# EAGLE schematic MOSFETboard (EAGLE 9.6.2)
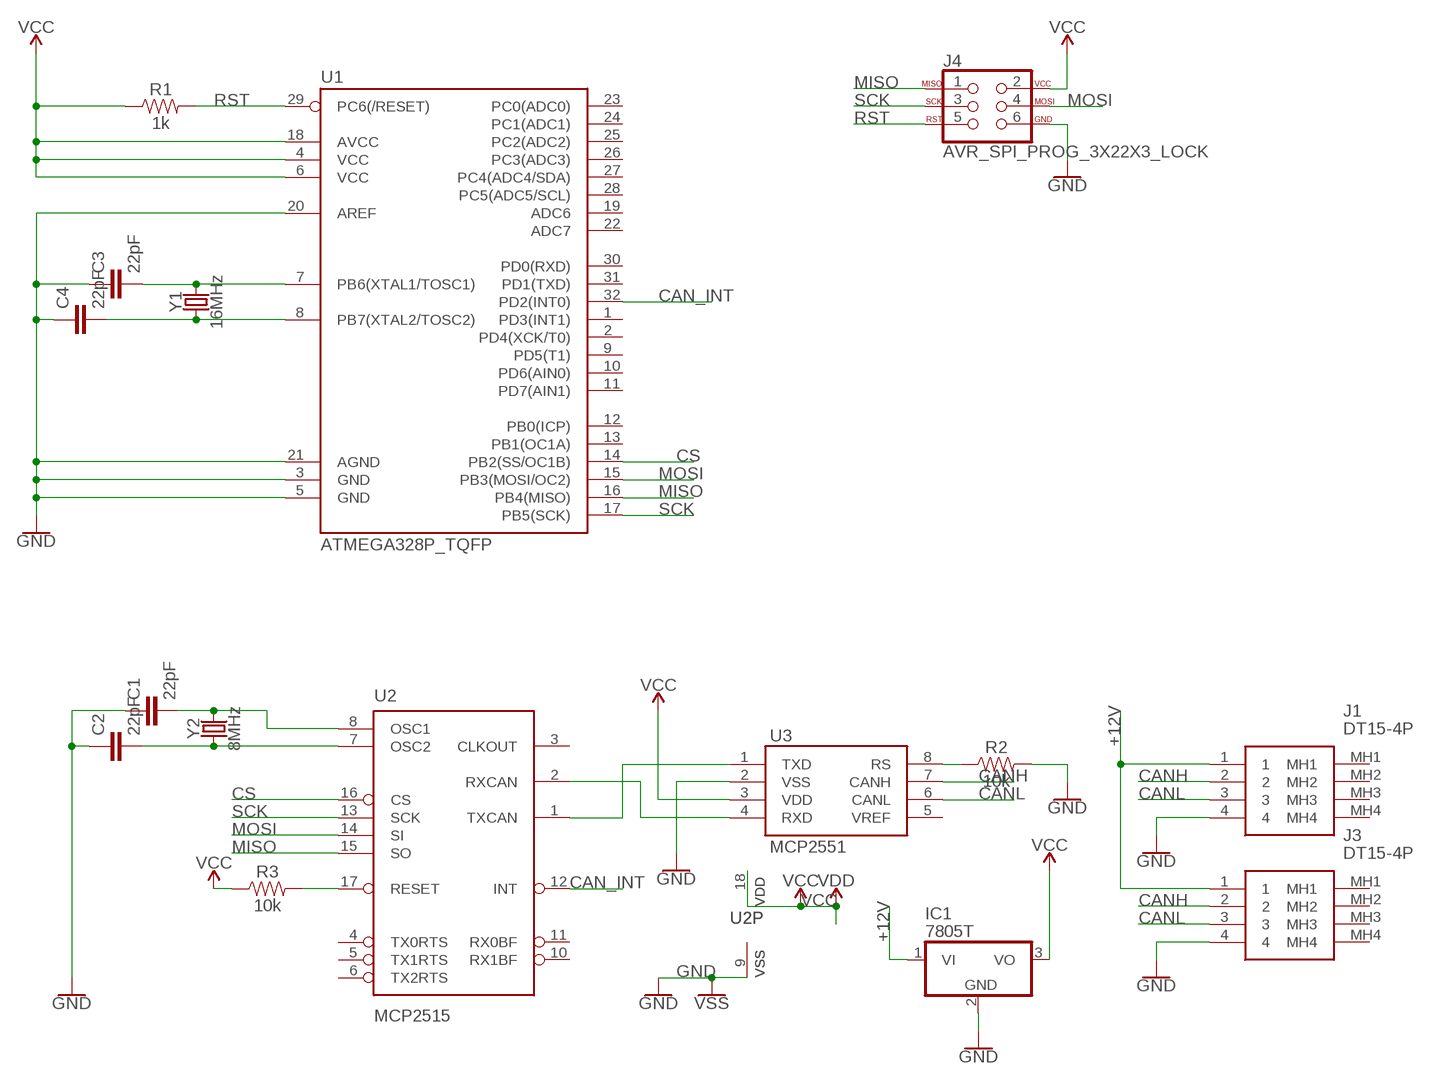
[diagram p0: schematic, sheet 1, part 1 of 2]
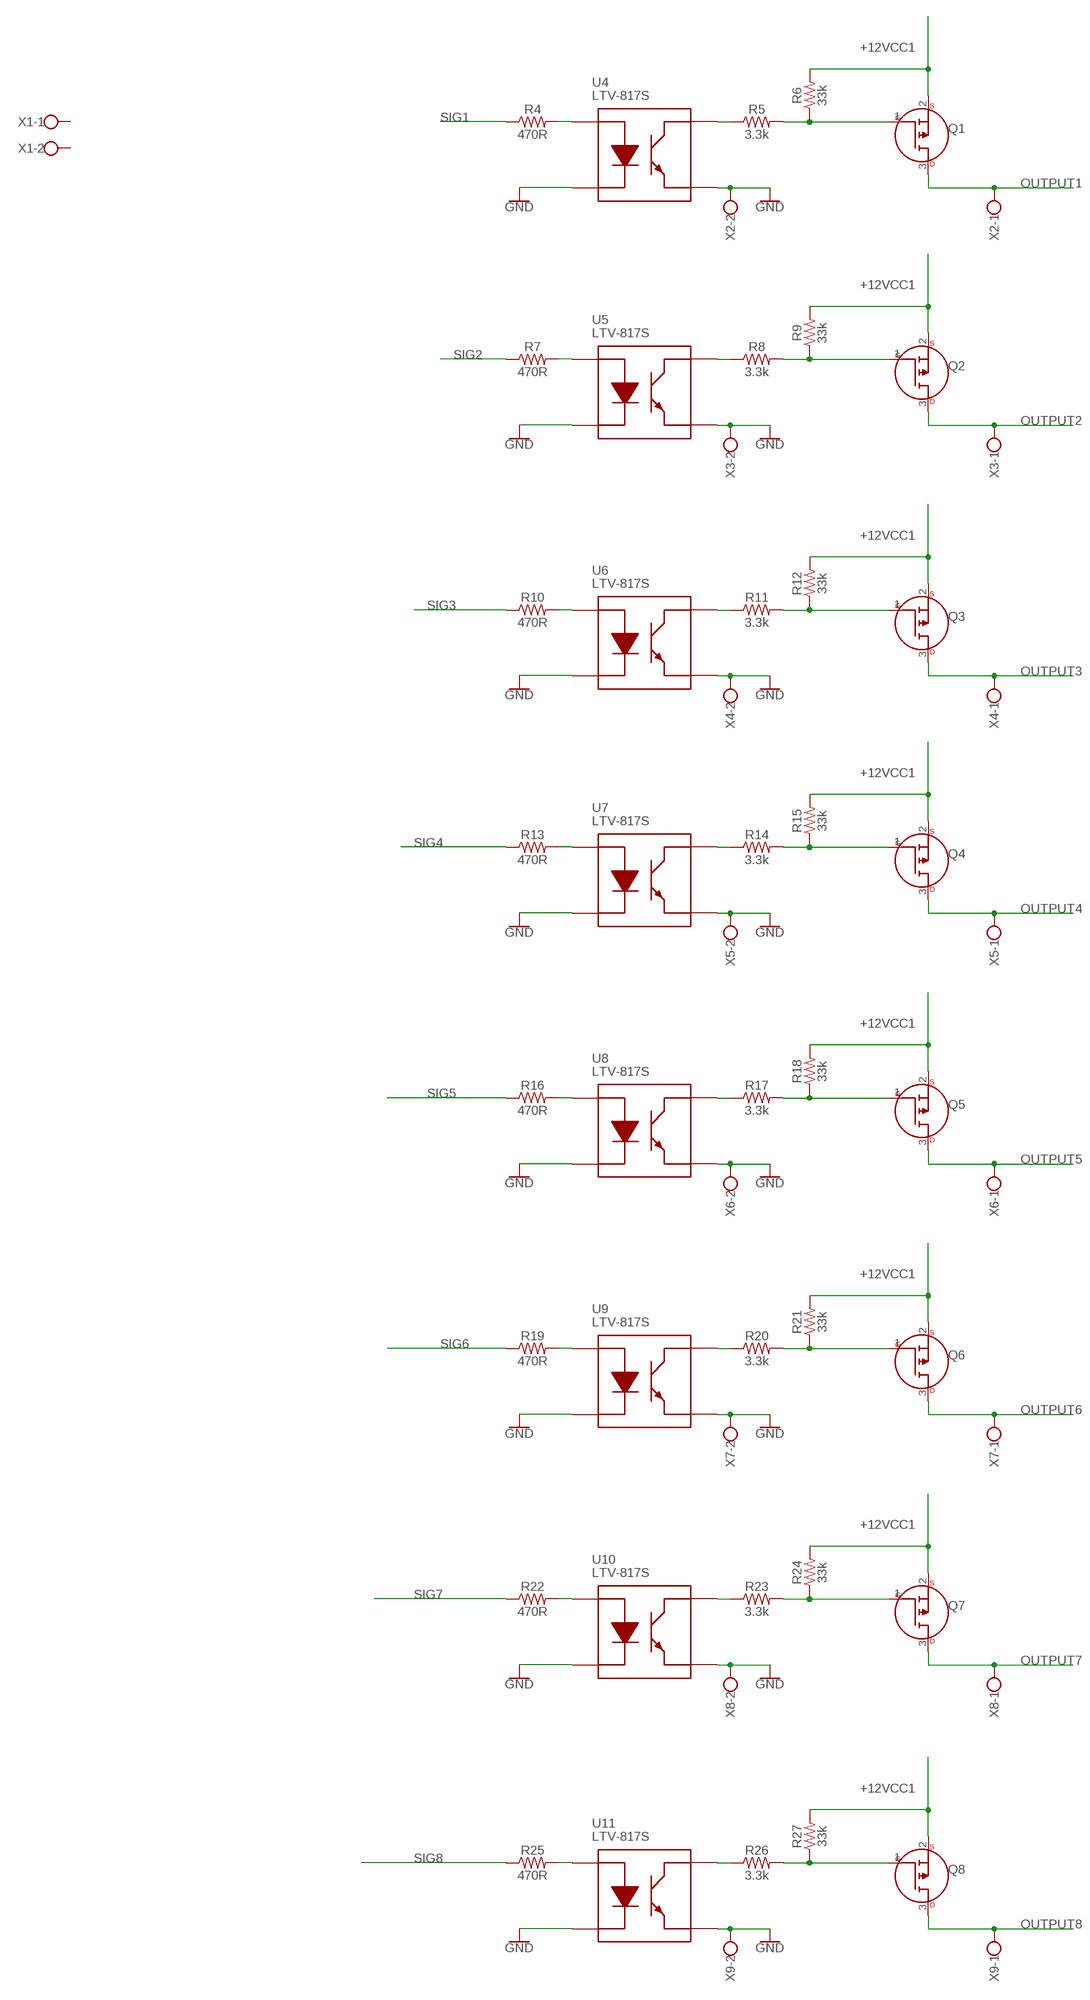
[diagram p1: schematic, sheet 1, part 2 of 2]

## Parts
C1  22pF  22PF-0603-50V-5%  [0603]
C2  22pF  22PF-0603-50V-5%  [0603]
C3  22pF  22PF-0603-50V-5%  [0603]
C4  22pF  22PF-0603-50V-5%  [0603]
IC1  7805T  [TO220H]
J1  DT15-4P  [DT154P]
J3  DT15-4P  [DT154P]
J4  AVR_SPI_PROG_3X22X3_LOCK  [2X3_LOCK]
Q1  IRFR9014TRPBF-BE3  [IRFR9014TRPBFBE3]
Q2  IRFR9014TRPBF-BE3  [IRFR9014TRPBFBE3]
Q3  IRFR9014TRPBF-BE3  [IRFR9014TRPBFBE3]
Q4  IRFR9014TRPBF-BE3  [IRFR9014TRPBFBE3]
Q5  IRFR9014TRPBF-BE3  [IRFR9014TRPBFBE3]
Q6  IRFR9014TRPBF-BE3  [IRFR9014TRPBFBE3]
Q7  IRFR9014TRPBF-BE3  [IRFR9014TRPBFBE3]
Q8  IRFR9014TRPBF-BE3  [IRFR9014TRPBFBE3]
R1  1k  1KOHM-0603-1/10W-1%  [0603]
R2  10k  1KOHM-0603-1/10W-1%  [0603]
R3  10k  1KOHM-0603-1/10W-1%  [0603]
R4  470R  1KOHM-0603-1/10W-1%  [0603]
R5  3.3k  1KOHM-0603-1/10W-1%  [0603]
R6  33k  1KOHM-0603-1/10W-1%  [0603]
R7  470R  1KOHM-0603-1/10W-1%  [0603]
R8  3.3k  1KOHM-0603-1/10W-1%  [0603]
R9  33k  1KOHM-0603-1/10W-1%  [0603]
R10  470R  1KOHM-0603-1/10W-1%  [0603]
R11  3.3k  1KOHM-0603-1/10W-1%  [0603]
R12  33k  1KOHM-0603-1/10W-1%  [0603]
R13  470R  1KOHM-0603-1/10W-1%  [0603]
R14  3.3k  1KOHM-0603-1/10W-1%  [0603]
R15  33k  1KOHM-0603-1/10W-1%  [0603]
R16  470R  1KOHM-0603-1/10W-1%  [0603]
R17  3.3k  1KOHM-0603-1/10W-1%  [0603]
R18  33k  1KOHM-0603-1/10W-1%  [0603]
R19  470R  1KOHM-0603-1/10W-1%  [0603]
R20  3.3k  1KOHM-0603-1/10W-1%  [0603]
R21  33k  1KOHM-0603-1/10W-1%  [0603]
R22  470R  1KOHM-0603-1/10W-1%  [0603]
R23  3.3k  1KOHM-0603-1/10W-1%  [0603]
R24  33k  1KOHM-0603-1/10W-1%  [0603]
R25  470R  1KOHM-0603-1/10W-1%  [0603]
R26  3.3k  1KOHM-0603-1/10W-1%  [0603]
R27  33k  1KOHM-0603-1/10W-1%  [0603]
U1  ATMEGA328P_TQFP  [TQFP32-08]
U2  MCP2515  MCP2515(MCP2510)SO  [SO18W]
U3  MCP2551  [SO08]
U4  LTV-817S  [SOP254P1016X460-4N]
U5  LTV-817S  [SOP254P1016X460-4N]
U6  LTV-817S  [SOP254P1016X460-4N]
U7  LTV-817S  [SOP254P1016X460-4N]
U8  LTV-817S  [SOP254P1016X460-4N]
U9  LTV-817S  [SOP254P1016X460-4N]
U10  LTV-817S  [SOP254P1016X460-4N]
U11  LTV-817S  [SOP254P1016X460-4N]
X1  W237-102  [W237-102]
X2  W237-102  [W237-102]
X3  W237-102  [W237-102]
X4  W237-102  [W237-102]
X5  W237-102  [W237-102]
X6  W237-102  [W237-102]
X7  W237-102  [W237-102]
X8  W237-102  [W237-102]
X9  W237-102  [W237-102]
Y1  16MHz  CRYSTAL-8MHZSMD-HC49UP  [HC49UP]
Y2  8MHz  CRYSTAL-8MHZSMD-HC49UP  [HC49UP]

## Nets
+12V: IC1.1(VI) J1.1 J3.1
+12VCC1: Q1.2(D) Q2.2(D) Q3.2(D) Q4.2(D) Q5.2(D) Q6.2(D) Q7.2(D) Q8.2(D) R6.2 R9.2 R12.2 R15.2 R18.2 R21.2 R24.2 R27.2
CAN_INT: U1.32(PD2(INT0)) U2.12(INT)
CANH: J1.2 J3.2 U3.7(CANH)
CANL: J1.3 J3.3 U3.6(CANL)
CS: U1.14(PB2(SS/OC1B)) U2.16(CS)
GND: C1.1 C2.1 C3.1 C4.1 IC1.2(GND) J1.4 J3.4 J4.6 R2.2 U1.3(GND) U1.5(GND) U1.20(AREF) U1.21(AGND) U2.9(VSS) U3.2(VSS) U4.2(CATHODE) U4.3(EMITTER) U5.2(CATHODE) U5.3(EMITTER) U6.2(CATHODE) U6.3(EMITTER) U7.2(CATHODE) U7.3(EMITTER) U8.2(CATHODE) U8.3(EMITTER) U9.2(CATHODE) U9.3(EMITTER) U10.2(CATHODE) U10.3(EMITTER) U11.2(CATHODE) U11.3(EMITTER) X2.2 X3.2 X4.2 X5.2 X6.2 X7.2 X8.2 X9.2 ; supply symbol labelled VSS
MISO: J4.1 U1.16(PB4(MISO)) U2.15(SO)
MOSI: J4.4 U1.15(PB3(MOSI/OC2)) U2.14(SI)
N$1: U2.1(TXCAN) U3.1(TXD)
N$2: U2.2(RXCAN) U3.4(RXD)
N$3: C2.2 U2.7(OSC2) Y2.1
N$4: C1.2 U2.8(OSC1) Y2.2
N$5: C4.2 U1.8(PB7(XTAL2/TOSC2)) Y1.1
N$6: C3.2 U1.7(PB6(XTAL1/TOSC1)) Y1.2
N$7: R2.1 U3.8(RS)
N$8: R3.2 U2.17(RESET)
N$9: R4.2 U4.1(ANODE)
N$10: R5.1 U4.4(COLLECTOR)
N$11: Q1.1(G) R5.2 R6.1
N$12: R7.2 U5.1(ANODE)
N$13: R8.1 U5.4(COLLECTOR)
N$14: Q2.1(G) R8.2 R9.1
N$15: R10.2 U6.1(ANODE)
N$16: R11.1 U6.4(COLLECTOR)
N$17: Q3.1(G) R11.2 R12.1
N$18: R13.2 U7.1(ANODE)
N$19: R14.1 U7.4(COLLECTOR)
N$20: Q4.1(G) R14.2 R15.1
N$21: R16.2 U8.1(ANODE)
N$22: R17.1 U8.4(COLLECTOR)
N$23: Q5.1(G) R17.2 R18.1
N$24: R19.2 U9.1(ANODE)
N$25: R20.1 U9.4(COLLECTOR)
N$26: Q6.1(G) R20.2 R21.1
N$27: R22.2 U10.1(ANODE)
N$28: R23.1 U10.4(COLLECTOR)
N$29: Q7.1(G) R23.2 R24.1
N$30: R25.2 U11.1(ANODE)
N$31: R26.1 U11.4(COLLECTOR)
N$32: Q8.1(G) R26.2 R27.1
OUTPUT1: Q1.3(S) X2.1
OUTPUT2: Q2.3(S) X3.1
OUTPUT3: Q3.3(S) X4.1
OUTPUT4: Q4.3(S) X5.1
OUTPUT5: Q5.3(S) X6.1
OUTPUT6: Q6.3(S) X7.1
OUTPUT7: Q7.3(S) X8.1
OUTPUT8: Q8.3(S) X9.1
RST: J4.5 R1.2 U1.29(PC6(/RESET))
SCK: J4.3 U1.17(PB5(SCK)) U2.13(SCK)
SIG1: R4.1
SIG2: R7.1
SIG3: R10.1
SIG4: R13.1
SIG5: R16.1
SIG6: R19.1
SIG7: R22.1
SIG8: R25.1
VCC: IC1.3(VO) J4.2 R1.1 R3.1 U1.4(VCC) U1.6(VCC) U1.18(AVCC) U2.18(VDD) U3.3(VDD) ; supply symbol labelled VDD
Unconnected: J1.MH1 J1.MH2 J1.MH3 J1.MH4 J3.MH1 J3.MH2 J3.MH3 J3.MH4 U1.1(PD3(INT1)) U1.2(PD4(XCK/T0)) U1.9(PD5(T1)) U1.10(PD6(AIN0)) U1.11(PD7(AIN1)) U1.12(PB0(ICP)) U1.13(PB1(OC1A)) U1.19(ADC6) U1.22(ADC7) U1.23(PC0(ADC0)) U1.24(PC1(ADC1)) U1.25(PC2(ADC2)) U1.26(PC3(ADC3)) U1.27(PC4(ADC4/SDA)) U1.28(PC5(ADC5/SCL)) U1.30(PD0(RXD)) U1.31(PD1(TXD)) U2.3(CLKOUT) U2.4(TX0RTS) U2.5(TX1RTS) U2.6(TX2RTS) U2.10(RX1BF) U2.11(RX0BF) U3.5(VREF) X1.1 X1.2

## Library data of the parts
C1-C4 = SparkFun-Capacitors:22PF: 22pF ceramic capacitors A capacitor is a passive two-terminal electrical component used to store electrical energy temporarily in an electric field.; PROD_ID: CAP-07876
IC1 = linear:78*: Positive VOLTAGE REGULATOR Source: http://cache.national.com/ds/LM/LM78L05.pdf http://www.fairchildsemi.com/ds/LM/LM7805.pdf
J1 J3 = DT15-4P:DT15-4P: Deutsch DT15 Series, 4.44mm Pitch 4 Way 2 Row Straight PCB Header, Solder Termination Source: Datasheet <https://www.te.com/commerce/DocumentDelivery/DDEController?Action=showdoc&DocId=Customer DrawingDT15-4PD2pdfEnglishENG_CD_DT15-4P_D2.pdfDT15-4P>; DESCRIPTION: Deutsch DT15 Series, 4.44mm Pitch 4 Way 2 Row Straight PCB Header, Solder Termination; HEIGHT: 30.35mm; MANUFACTURER_NAME: TE Connectivity; MANUFACTURER_PART_NUMBER: DT15-4P; MOUSER_PART_NUMBER: 571-DT15-4P; MOUSER_PRICE-STOCK: https://www.mouser.co.uk/ProductDetail/TE-Connectivity-DEUTSCH/DT15-4P?qs=vkMqrgFpRajtjo1r4fVe%2Fw%3D%3D
J4 = SparkFun-Connectors:AVR_SPI_PROG_3X2: AVR ISP 6 Pin This is the reduced ISP connector for AVR programming. Common on Arduino. This footprint will take up less PCB space and can be used with a 10-pin to 6-pin adapter such as SKU: BOB-08508 **Special note about "TEST_POINT" package. The stop mask is on the top side, so if you want your programming test points to be on the bottom of your board, make sure to place this package on the bottom side of the board. This also ensure that the orientation to program from the bottom side will be correct. SparkFun Products: SparkFun ISP Pogo Adapter <https://www.sparkfun.com/products/11591> - NS Tiny AVR Programmer <https://www.sparkfun.com/products/11801> -PTH
Q1-Q8 = SamacSys_Parts:IRFR9014TRPBF-BE3: MOSFET 60V P-CH HEXFET MOSFET D Source: Datasheet; DESCRIPTION: MOSFET 60V P-CH HEXFET MOSFET D; HEIGHT: 2.38mm; MANUFACTURER_NAME: Vishay; MANUFACTURER_PART_NUMBER: IRFR9014TRPBF-BE3; MOUSER_PART_NUMBER: 78-IRFR9014TRPBF-BE3; MOUSER_PRICE-STOCK: https://www.mouser.co.uk/ProductDetail/Vishay-Siliconix/IRFR9014TRPBF-BE3?qs=7MVldsJ5UaztV2jQZzH2pA%3D%3D
R1 = SparkFun-Resistors:1KOHM: 1kΩ resistor A resistor is a passive two-terminal electrical component that implements electrical resistance as a circuit element. Resistors act to reduce current flow, and, at the same time, act to lower voltage levels within circuits. - Wikipedia; PROD_ID: RES-07856
R2-R27 = SparkFun-Resistors:1KOHM: 1kΩ resistor A resistor is a passive two-terminal electrical component that implements electrical resistance as a circuit element. Resistors act to reduce current flow, and, at the same time, act to lower voltage levels within circuits. - Wikipedia; PROD_ID: RES-07856; VALUE: 1k
U1 = SparkFun-IC-Microcontroller:ATMEGA328P_TQFP: Popular 328P in QFP Storefront component: ATmega328 - TQFP <https://www.sparkfun.com/products/13448> (COM-13448) Datasheet <http://www.sparkfun.com/datasheets/Components/SMD/ATMega328.pdf> SparkFun Products SparkFun RedBoard - Programmed with Arduino <https://www.sparkfun.com/products/12757> (DEV-12757) Arduino Pro Mini 328 - 5V/16MHz <https://www.sparkfun.com/products/11113> (DEV-11113) Arduino Pro Mini 328 - 3.3V/8MHz <https://www.sparkfun.com/products/11114> (DEV-11114) SparkFun OpenLog <https://www.sparkfun.com/products/13712> (DEV-13712) SparkFun MicroView - OLED Arduino Module <https://www.sparkfun.com/products/12923> (DEV-12923) SparkFun Digital Sandbox <https://www.sparkfun.com/products/12651> (DEV-12651) SparkFun PicoBoard <https://www.sparkfun.com/products/11888> (WIG-11888) Arduino Fio <https://www.sparkfun.com/products/10116> (DEV-10116) LilyPad Arduino 328 Main Board <https://www.sparkfun.com/products/13342> (DEV-13342) SparkFun RedStick <https://www.sparkfun.com/products/13741> (DEV-13741) LilyPad MP3 <https://www.sparkfun.com/products/11013> (DEV-11013) LilyPad Arduino SimpleSnap <https://www.sparkfun.com/products/10941> (DEV-10941) SparkFun Stepoko <https://www.sparkfun.com/products/13899> (ROB-13899) SparkFun Geiger Counter <https://www.sparkfun.com/products/11345> (SEN-11345) SparkFun EL Sequencer <https://www.sparkfun.com/products/12781> (COM-12781) Arduino Pro 328 - 5V/16MHz <https://www.sparkfun.com/products/10915> (DEV-10915) CryptoCape <https://www.sparkfun.com/products/12773> (DEV-12773) SparkFun IR Thermometer Evaluation Board - MLX90614 <https://www.sparkfun.com/products/10740> (SEN-10740) SparkFun RedBot Mainboard <https://www.sparkfun.com/products/12097> (ROB-12097) Arduino Pro 328 - 3.3V/8MHz <https://www.sparkfun.com/products/10914> (DEV-10914) SparkFun Block for Intel® Edison - Arduino <https://www.sparkfun.com/products/13036> (DEV-13036) SparkFun Simon Says - Surface Mount Soldering Kit <https://www.sparkfun.com/products/10935> (KIT-10935) SparkFun 7-Segment Serial Display - Red <https://www.sparkfun.com/products/11441> (COM-11441) SparkFun 7-Segment Serial Display - White <https://www.sparkfun.com/products/11629> (COM-11629) SparkFun 7-Segment Serial Display - Yellow <https://www.sparkfun.com/products/11443> (COM-11443) SparkFun 7-Segment Serial Display - Kelly Green <https://www.sparkfun.com/products/11440> (COM-11440) SparkFun 7-Segment Serial Display - Blue <https://www.sparkfun.com/products/11442> (COM-11442) SparkFun OpenSegment Serial Display - 20mm (Blue) <https://www.sparkfun.com/products/11647> (COM-11647) SparkFun OpenSegment Serial Display - 20mm (Green) <https://www.sparkfun.com/products/11646> (COM-11646) SparkFun OpenSegment Serial Display - 20mm (White) <https://www.sparkfun.com/products/11648> (COM-11648) SparkFun OpenSegment Serial Display - 20mm (Red) <https://www.sparkfun.com/products/11644> (COM-11644) SparkFun OpenSegment Serial Display - 20mm (Yellow) <https://www.sparkfun.com/products/11645> (COM-11645) SparkFun OpenSegment Shield <https://www.sparkfun.com/products/13190> (DEV-13190); PROD_ID: IC-09069
U2 = SparkFun-IC-Comms:MCP2515(MCP2510): CAN controller with SPI interface The MCP2515 controller supercedes the MCP2510 while addressing all errata associated with it. The two devices are pin compatible, either can be used with this device. 18-pin package SOIC Simple SPI interface to any MCU. One-shot mode ensures message transmission is attempted only once Databyte filtering Start-of-Frame (SOF) output Low-power CMOS Technology Datasheet <http://www.sparkfun.com/datasheets/DevTools/Arduino/MCP2515.pdf> SparkFun Products CAN-BUS Shield <https://www.sparkfun.com/products/13262> (DEV-13262); PROD_ID: IC-09906
U3 = SparkFun-IC-Comms:MCP2551: MCP2551 High Speed CAN Transceiver High speed CAN transceiver Datasheet <http://www.sparkfun.com/datasheets/DevTools/Arduino/MCP2551.pdf> SparkFun Products CAN-BUS Shield <https://www.sparkfun.com/products/13262> (DEV-13262) SparkFun OBD-II UART <https://www.sparkfun.com/products/9555> (WIG-09555); PROD_ID: IC-09907
U4-U11 = SamacSys_Parts:LTV-817S: Optocoupler Transistor Output, 35V, SMD4 Lite-On LTV-817S DC Input Transistor Output Optocoupler, Surface Mount, 4-Pin SMD Source: Datasheet <http://optoelectronics.liteon.com/upload/download/DS-70-96-0016/LTV-8X7 series 201610 .pdf>; DESCRIPTION: Optocoupler Transistor Output, 35V, SMD4 Lite-On LTV-817S DC Input Transistor Output Optocoupler, Surface Mount, 4-Pin SMD; HEIGHT: 4.6mm; MANUFACTURER_NAME: Lite-On; MANUFACTURER_PART_NUMBER: LTV-817S; MOUSER_PART_NUMBER: 859-LTV-817S; MOUSER_PRICE-STOCK: https://www.mouser.co.uk/ProductDetail/Lite-On/LTV-817S?qs=XpF7qU%252BvLkWYeWEC0OckNQ%3D%3D
X1-X9 = con-wago-500:W237-102: WAGO SCREW CLAMP; MPN: 237-102; OC_FARNELL: unknown; OC_NEWARK: 70K9898
Y1 = SparkFun-Clocks:CRYSTAL-8MHZ: 8MHz Crystal Datasheet Example <http://www.futureelectronics.com/en/technologies/electromechanical/timing-devices/crystals/Pages/6008189-ABM3B-8.000MHZ-B2-T.aspx?IM=0> Frequency: 8MHz Frequency Tolerance: ±20ppm Load Capacitance: 18pF SparkFun Products: Pro Micro -3.3V/8MHz <https://www.sparkfun.com/products/12587> WAV Trigger <https://www.sparkfun.com/products/13660>; PROD_ID: XTAL-11706; VALUE: 8MHz
Y2 = SparkFun-Clocks:CRYSTAL-8MHZ: 8MHz Crystal Datasheet Example <http://www.futureelectronics.com/en/technologies/electromechanical/timing-devices/crystals/Pages/6008189-ABM3B-8.000MHZ-B2-T.aspx?IM=0> Frequency: 8MHz Frequency Tolerance: ±20ppm Load Capacitance: 18pF SparkFun Products: Pro Micro -3.3V/8MHz <https://www.sparkfun.com/products/12587> WAV Trigger <https://www.sparkfun.com/products/13660>; PROD_ID: XTAL-11706

## Net classes
0 default: width 0.305 mm